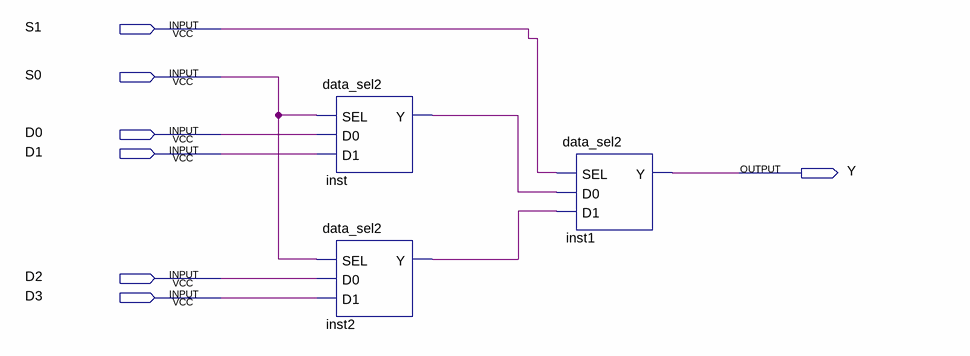
[diagram p0: schematic sheet]
// Quartus schematic data_sel4.bdf as structural Verilog: 3 symbols, 7 pins
module data_sel4 (
  input  S1,
  input  S0,
  input  D0,
  input  D1,
  input  D2,
  input  D3,
  output Y
);

  wire inst2_y, inst_y;

  data_sel2 inst (.SEL(S0), .D0(D0), .D1(D1), .Y(inst_y));
  data_sel2 inst2 (.SEL(S0), .D0(D2), .D1(D3), .Y(inst2_y));
  data_sel2 inst1 (.SEL(S1), .D0(inst_y), .D1(inst2_y), .Y(Y));
endmodule
